# Altium project 短学期.PrjPCB
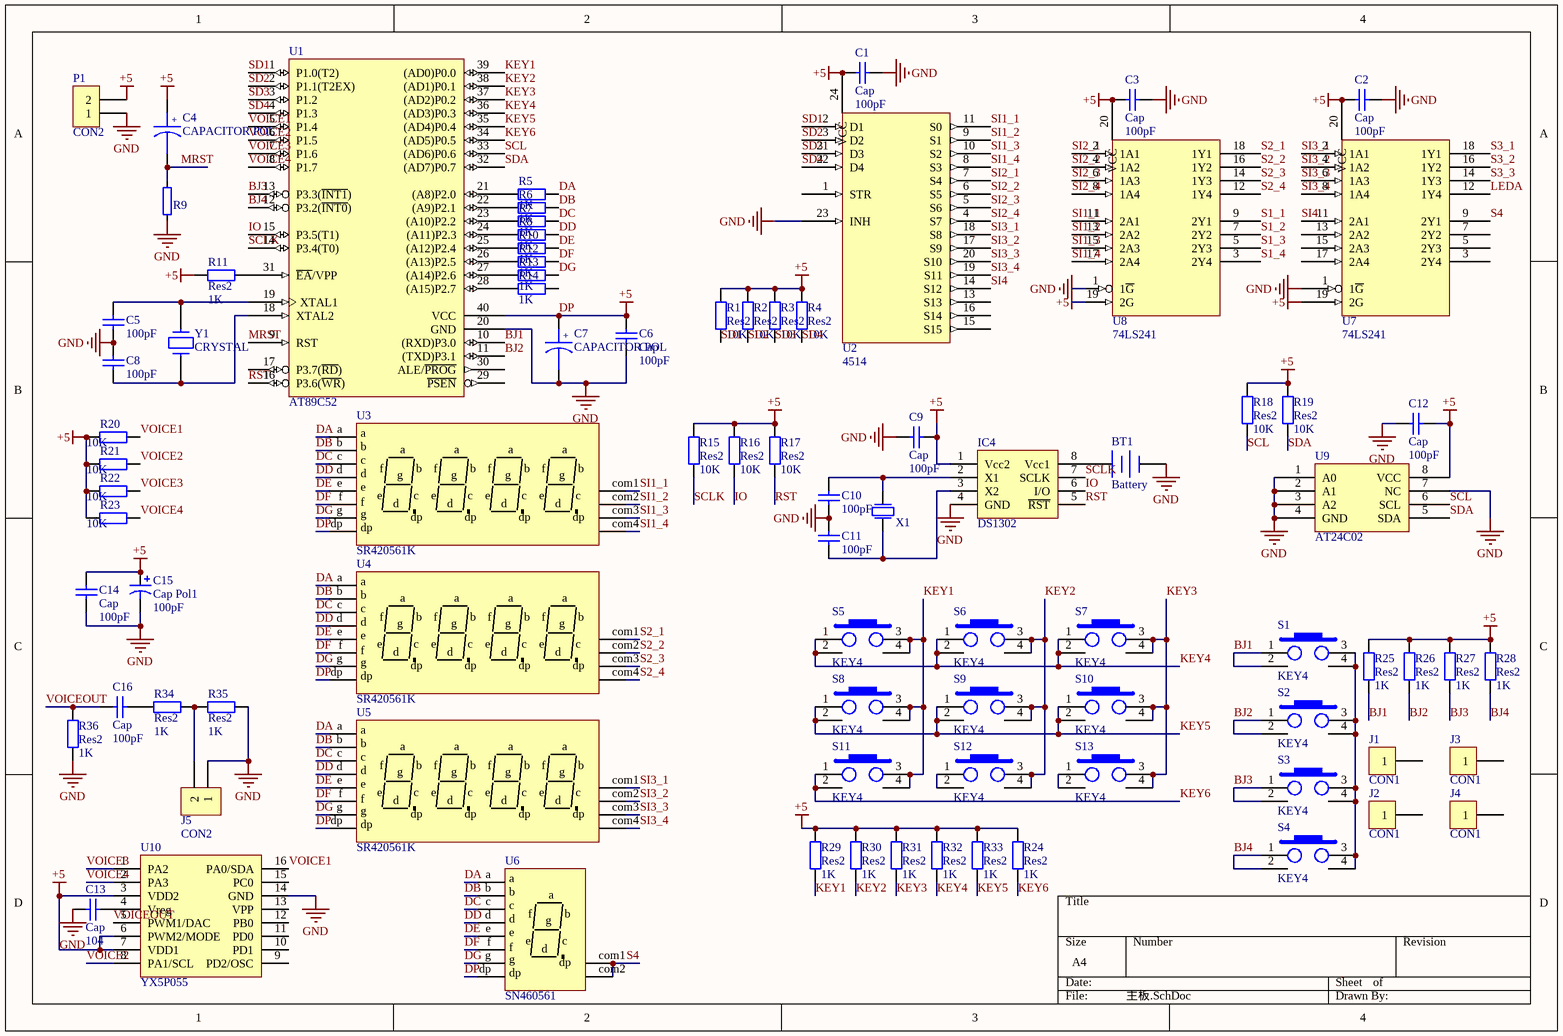
[diagram p0: 主板.SchDoc]
1 sheet, 85 parts. Net scope: global (net labels, ports and power ports of the same name join across sheets).
Board file: 主板.PcbDoc

## Sheet 主板.SchDoc
size A4

### Parts
BT1  Battery  [CR2032-2]
C1  Cap  value 100pF  [RAD-0.3]
C2  Cap  value 100pF  [RAD-0.3]
C3  Cap  value 100pF  [RAD-0.3]
C4  CAPACITOR POL  [22U1]
C5  value 100pF  [RAD-0.3]  (hidden comment: Cap)
C6  Cap  value 100pF  [RAD-0.3]
C7  CAPACITOR POL  [22U1]
C8  value 100pF  [RAD-0.3]  (hidden comment: Cap)
C9  Cap  value 100pF  [RAD-0.3]
C10  value 100pF  [RAD-0.3]  (hidden comment: Cap)
C11  value 100pF  [RAD-0.3]  (hidden comment: Cap)
C12  Cap  value 100pF  [RAD-0.3]
C13  Cap  value 104  [RAD-0.3]
C14  Cap  value 100pF  [RAD-0.3]
C15  Cap Pol1  value 100pF  [RB7.6-15]
C16  Cap  value 100pF  [RAD-0.3]
IC4  DS1302  [DIP8]
J1  CON1  [GDK]
J2  CON1  [GDK]
J3  CON1  [GDK]
J4  CON1  [GDK]
J5  CON2  [VOICE-1]
P1  CON2  [VOICE-1]
R1  Res2  value 10K  [AXIAL-0.4]
R2  Res2  value 10K  [AXIAL-0.4]
R3  Res2  value 10K  [AXIAL-0.4]
R4  Res2  value 10K  [AXIAL-0.4]
R5  value 1K  [AXIAL-0.4]  (hidden comment: Res2)
R6  value 1K  [AXIAL-0.4]  (hidden comment: Res2)
R7  value 1K  [AXIAL-0.4]  (hidden comment: Res2)
R8  value 1K  [AXIAL-0.4]  (hidden comment: Res2)
R9  R-10K  [0805R]  (value not drawn)
R10  value 1K  [AXIAL-0.4]  (hidden comment: Res2)
R11  Res2  value 1K  [AXIAL-0.4]
R12  value 1K  [AXIAL-0.4]  (hidden comment: Res2)
R13  value 1K  [AXIAL-0.4]  (hidden comment: Res2)
R14  value 1K  [AXIAL-0.4]  (hidden comment: Res2)
R15  Res2  value 10K  [AXIAL-0.4]
R16  Res2  value 10K  [AXIAL-0.4]
R17  Res2  value 10K  [AXIAL-0.4]
R18  Res2  value 10K  [AXIAL-0.4]
R19  Res2  value 10K  [AXIAL-0.4]
R20  value 10K  [AXIAL-0.4]  (hidden comment: Res2)
R21  value 10K  [AXIAL-0.4]  (hidden comment: Res2)
R22  value 10K  [AXIAL-0.4]  (hidden comment: Res2)
R23  value 10K  [AXIAL-0.4]  (hidden comment: Res2)
R24  Res2  value 1K  [AXIAL-0.4]
R25  Res2  value 1K  [AXIAL-0.4]
R26  Res2  value 1K  [AXIAL-0.4]
R27  Res2  value 1K  [AXIAL-0.4]
R28  Res2  value 1K  [AXIAL-0.4]
R29  Res2  value 1K  [AXIAL-0.4]
R30  Res2  value 1K  [AXIAL-0.4]
R31  Res2  value 1K  [AXIAL-0.4]
R32  Res2  value 1K  [AXIAL-0.4]
R33  Res2  value 1K  [AXIAL-0.4]
R34  Res2  value 1K  [AXIAL-0.4]
R35  Res2  value 1K  [AXIAL-0.4]
R36  Res2  value 1K  [AXIAL-0.4]
S1  KEY4  [PUSH12]
S2  KEY4  [PUSH12]
S3  KEY4  [PUSH12]
S4  KEY4  [PUSH12]
S5  KEY4  [PUSH12]
S6  KEY4  [PUSH12]
S7  KEY4  [PUSH12]
S8  KEY4  [PUSH12]
S9  KEY4  [PUSH12]
S10  KEY4  [PUSH12]
S11  KEY4  [PUSH12]
S12  KEY4  [PUSH12]
S13  KEY4  [PUSH12]
U1  AT89C52  [DIP40]
U2  4514  [SOP4510]
U3  SR420561K  [5462B]
U4  SR420561K  [5462B]
U5  SR420561K  [5462B]
U6  SN460561  [3121B]
U7  74LS241  [SOP241]
U8  74LS241  [SOP241]
U9  AT24C02  [DIP8]
U10  YX5P055  [DIP16]
X1  XTAL1  [X2]  (value not drawn)
Y1  CRYSTAL  [OSC2PR-1]

### Nets
DP: C1.2 C2.2 C3.2 C4.1 C6.1 C7.1 C9.2 C12.2 C14.2 C15.1 IC4.1(Vcc2) P1.2 R1.2 R2.2 R3.2 R4.2 R11.1 R15.2 R16.2 R17.2 R18.2 R19.2 R20.2 R21.2 R22.2 R23.2 R24.2 R25.2 R26.2 R27.2 R28.2 R29.2 R30.2 R31.2 R32.2 R33.2 U1.40(VCC) U2.24(VCC) U3.dp U4.dp U5.dp U6.dp U7.19(2G) U7.20(VCC) U8.19(2G) U8.20(VCC) U9.8(VCC) U10.3(VDD2) U10.6(PWM2/MODE) U10.7(VDD1)  [also labelled +5]
GND: BT1.2(-) C1.1 C2.1 C3.1 C5.2 C6.2 C7.2 C8.1 C9.1 C10.2 C11.1 C12.1 C13.1 C14.1 C15.2 IC4.4(GND) J5.1 P1.1 R9.1 R35.2 R36.1 U1.20(GND) U2.12(GND) U2.23(INH) U7.1(1~{G}) U7.10(GND) U8.1(1~{G}) U8.10(GND) U9.1(A0) U9.2(A1) U9.3(A2) U9.4(GND) U9.7(NC) U10.14(GND)
BJ1: R25.1 S1.1 S1.2 U1.10((RXD)P3.0)
BJ2: R26.1 S2.1 S2.2 U1.11((TXD)P3.1)
BJ3: R27.1 S3.1 S3.2 U1.13(P3.3(~{INT1}))
BJ4: R28.1 S4.1 S4.2 U1.12(P3.2(~{INT0}))
DA: R5.2 U3.a U4.a U5.a U6.a
DB: R6.2 U3.b U4.b U5.b U6.b
DC: R7.2 U3.c U4.c U5.c U6.c
DD: R8.2 U3.d U4.d U5.d U6.d
DE: R10.2 U3.e U4.e U5.e U6.e
DF: R12.2 U3.f U4.f U5.f U6.f
DG: R13.2 U3.g U4.g U5.g U6.g
IO: IC4.6(I/O) R16.1 U1.15(P3.5(T1))
KEY1: R29.1 S5.3 S5.4 S8.3 S8.4 S11.3 S11.4 U1.39((AD0)P0.0)
KEY2: R30.1 S6.3 S6.4 S9.3 S9.4 S12.3 S12.4 U1.38((AD1)P0.1)
KEY3: R31.1 S7.3 S7.4 S10.3 S10.4 S13.3 S13.4 U1.37((AD2)P0.2)
KEY4: R32.1 S5.1 S5.2 S6.1 S6.2 S7.1 S7.2 U1.36((AD3)P0.3)
KEY5: R33.1 S8.1 S8.2 S9.1 S9.2 S10.1 S10.2 U1.35((AD4)P0.4)
KEY6: R24.1 S11.1 S11.2 U1.34((AD5)P0.5)
LEDA: U7.12(1Y4)
MRST: C4.2 R9.2 U1.9(RST)
RST: IC4.5(~{RST}) R17.1 U1.16(P3.6(~{WR}))
S1_1: U8.9(2Y1)
S1_2: U8.7(2Y2)
S1_3: U8.5(2Y3)
S1_4: U8.3(2Y4)
S2_1: U4.com1 U8.18(1Y1)
S2_2: U4.com2 U8.16(1Y2)
S2_3: U4.com3 U8.14(1Y3)
S2_4: U4.com4 U8.12(1Y4)
S3_1: U7.18(1Y1)
S3_2: U7.16(1Y2)
S3_3: U7.14(1Y3)
S4: U6.com1 U6.com2 U7.9(2Y1)
SCL: R18.1 U1.33((AD6)P0.6) U9.6(SCL)
SCLK: IC4.7(SCLK) R15.1 U1.14(P3.4(T0))
SD1: R1.1 U1.1(P1.0(T2)) U2.2(D1)
SD2: R2.1 U1.2(P1.1(T2EX)) U2.3(D2)
SD3: R3.1 U1.3(P1.2) U2.21(D3)
SD4: R4.1 U1.4(P1.3) U2.22(D4)
SDA: R19.1 U1.32((AD7)P0.7) U9.5(SDA)
SI1_1: U2.11(S0) U3.com1 U8.11(2A1)
SI1_2: U2.9(S1) U3.com2 U8.13(2A2)
SI1_3: U2.10(S2) U3.com3 U8.15(2A3)
SI1_4: U2.8(S3) U3.com4 U8.17(2A4)
SI2_1: U2.7(S4) U8.2(1A1)
SI2_2: U2.6(S5) U8.4(1A2)
SI2_3: U2.5(S6) U8.6(1A3)
SI2_4: U2.4(S7) U8.8(1A4)
SI3_1: U2.18(S8) U5.com1 U7.2(1A1)
SI3_2: U2.17(S9) U5.com2 U7.4(1A2)
SI3_3: U2.20(S10) U5.com3 U7.6(1A3)
SI3_4: U2.19(S11) U5.com4 U7.8(1A4)
SI4: U2.14(S12) U7.11(2A1)
VOICE1: R20.1 U1.5(P1.4) U10.16(PA0/SDA)
VOICE2: R21.1 U1.6(P1.5) U10.8(PA1/SCL)
VOICE3: R22.1 U1.7(P1.6) U10.1(PA2)
VOICE4: R23.1 U1.8(P1.7) U10.2(PA3)
VOICEOUT: C16.1 R36.2 U10.5(PWM1/DAC)
NetBT1_1: BT1.1(+) IC4.8(Vcc1)
NetC5_1: C5.1 U1.19(XTAL1) Y1.2
NetC8_2: C8.2 U1.18(XTAL2) Y1.1
NetC10_1: C10.1 IC4.2(X1) X1.2(P2)
NetC11_2: C11.2 IC4.3(X2) X1.1(P1)
NetC13_2: C13.2 U10.4(Vreg)
NetC16_2: C16.2 R34.1
NetJ5_2: J5.2 R34.2 R35.1
NetR5_1: R5.1 U1.21((A8)P2.0)
NetR6_1: R6.1 U1.22((A9)P2.1)
NetR7_1: R7.1 U1.23((A10)P2.2)
NetR8_1: R8.1 U1.24((A11)P2.3)
NetR10_1: R10.1 U1.25((A12)P2.4)
NetR11_2: R11.2 U1.31(~{EA}/VPP)
NetR12_1: R12.1 U1.26((A13)P2.5)
NetR13_1: R13.1 U1.27((A14)P2.6)
NetR14_1: R14.1 U1.28((A15)P2.7)
NetS1_3: S1.3 S1.4 S2.3 S2.4 S3.3 S3.4 S4.3 S4.4
NetS12_1: S12.1 S12.2
NetS13_1: S13.1 S13.2

Not connected (* = marked no-connect by the designer): J1 1; J2 1; J3 1; J4 1; R14 2; U1 17(P3.7(~{RD})) 29(~{PSEN}) 30(ALE/~{PROG}); U2 1(STR) 13(S13) 15(S15) 16(S14); U7 3(2Y4) 5(2Y3) 7(2Y2) 13(2A2) 15(2A3) 17(2A4); U10 9(PD2/OSC) 10(PD1) 11(PD0) 12(PB0) 13(VPP) 15(PC0)

### Notes on the sheet
- (in symbol CAPACITOR POL) +

### Library data of the parts
BT1 = Battery: Multicell Battery; Published: *; LatestRevisionDate: *; LatestRevisionNote: *; PackageReference: *; Publisher: *
C1-C3 C5 C6 C8-C14 C16 = Cap: Capacitor; Published: 8-Jun-2000; LatestRevisionDate: 17-Jul-2002; LatestRevisionNote: Re-released for DXP Platform.; PackageReference: RAD-0.3; Publisher: Altium Limited
C4 C7 = CAPACITOR POL: Capacitor
C15 = Cap Pol1: Polarized Capacitor (Radial); Published: 8-Jun-2000; LatestRevisionDate: 17-Jul-2002; LatestRevisionNote: Re-released for DXP Platform.; PackageReference: RB7.6-15; Publisher: Altium Limited
J1-J4 = CON1: Connector
J5 P1 = CON2: Connector
R1-R8 R10-R36 = Res2: Resistor; Published: 8-Jun-2000; LatestRevisionDate: 17-Jul-2002; LatestRevisionNote: Re-released for DXP Platform.; PackageReference: AXIAL-0.4; Publisher: Altium Limited
R9 = R-10K: resistor
U1 = AT89C52: 8-Bit Microcontroller with 8K Flash ROM
U3-U5 = SR420561K: CP-SR420561K
U6 = SN460561: CP-SN460561K
U9 = AT24C02: U?